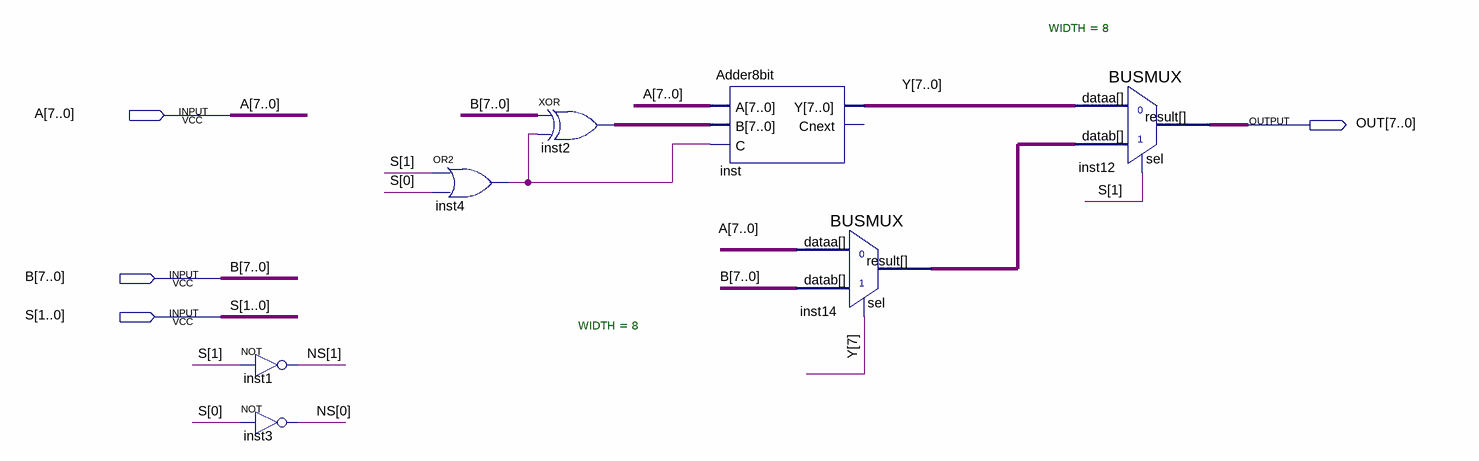
[diagram p0: schematic sheet]
// Quartus schematic AddSubMax.bdf as structural Verilog: 7 symbols, 4 pins
module AddSubMax (
  input  [7:0] A,
  input  [7:0] B,
  input  [1:0] S,
  output [7:0] OUT
);

  wire inst4_out;
  wire [1:0] NS;
  wire [7:0] inst2_out, inst14_result, Y;

  not inst1 (NS[1], S[1]);
  not inst3 (NS[0], S[0]);
  or inst4 (inst4_out, S[1], S[0]);
  assign inst2_out = B ^ {8{inst4_out}};  // XOR inst2, 8 bits wide
  Adder8bit inst (.A(A), .B(inst2_out), .C(inst4_out), .Y(Y));  // open: Cnext
  BUSMUX #(.WIDTH(8)) inst14 (.datab(B), .sel(Y[7]), .dataa(A), .result(inst14_result));
  BUSMUX #(.WIDTH(8)) inst12 (.datab(inst14_result), .sel(S[1]), .dataa(Y), .result(OUT));
endmodule
